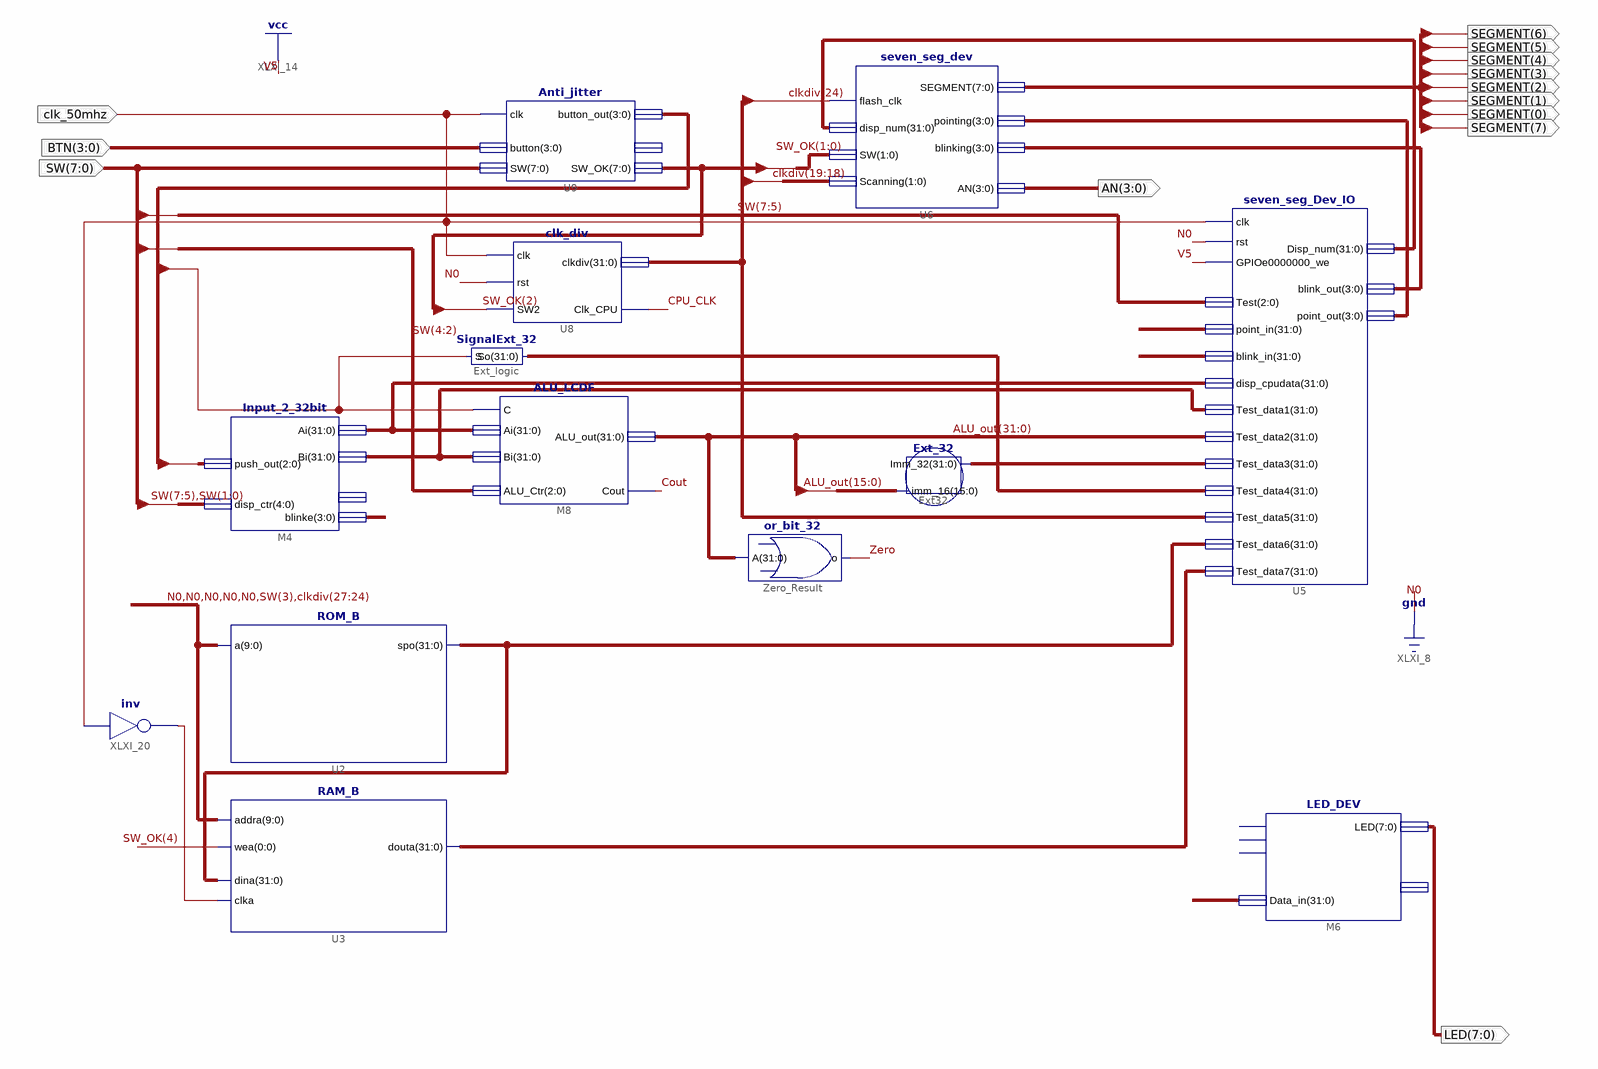
[diagram p0: schematic sheet 1]
// Xilinx ISE schematic Top.sch (spartan6) as structural Verilog: 13 symbols, 13 ports
module Top (
  input  [3:0] BTN,
  input  [7:0] SW,
  input  clk_50mhz,
  output [3:0] AN,
  output [7:0] LED,
  output [7:0] SEGMENT
);

  wire Cout, CPU_CLK, XLXN_200, Zero;
  wire [3:0] blinke, button_out, XLXN_17, XLXN_18;
  wire [7:0] SW_OK;
  wire [31:0] ALU_out, clkdiv, XLXN_53, XLXN_163, XLXN_164, XLXN_192, XLXN_201, XLXN_202, XLXN_207;

  Anti_jitter U9 (
    .clk(clk_50mhz), .SW(SW), .button_out(button_out), .SW_OK(SW_OK), .button(BTN));  // open: button_pulse
  Input_2_32bit M4 (
    .blinke(blinke), .disp_ctr({SW[7:5], SW[1:0]}), .Ai(XLXN_163), .push_out(button_out[2:0]), .Bi(XLXN_164));  // open: state
  ALU_LCDF M8 (.C(button_out[0]), .ALU_Ctr(SW[4:2]), .Ai(XLXN_163), .Bi(XLXN_164), .ALU_out(ALU_out), .Cout(Cout));
  LED_DEV M6 (
    .LED(LED), .Data_in({{24{1'b0}}, SW[1], CPU_CLK, Cout, Zero, clkdiv[27:24]}));  // open: clk, rst, EN, Other_out
  clk_div U8 (.clk(clk_50mhz), .rst(1'b0), .SW2(SW_OK[2]), .clkdiv(clkdiv), .Clk_CPU(CPU_CLK));
  Ext_32 Ext32 (.imm_16(ALU_out[15:0]), .Imm_32(XLXN_192));
  or_bit_32 Zero_Result (.o(Zero), .A(ALU_out));
  RAM_B U3 (
    .addra({{5{1'b0}}, SW[3], clkdiv[27:24]}), .clka(XLXN_200), .wea(SW_OK[4]), .dina(XLXN_201),
    .douta(XLXN_202));
  not XLXI_20 (XLXN_200, clk_50mhz);
  SignalExt_32 Ext_logic (.So(XLXN_207), .S(button_out[0]));
  ROM_B U2 (.a({{5{1'b0}}, SW[3], clkdiv[27:24]}), .spo(XLXN_201));
  seven_seg_Dev_IO U5 (
    .clk(clk_50mhz), .Test(SW[7:5]), .point_in({32{1'b1}}), .blink_in({{24{1'b0}}, blinke, blinke}),
    .disp_cpudata(XLXN_163), .Test_data1(XLXN_164), .Test_data2(ALU_out), .Test_data3(XLXN_192),
    .Test_data4(XLXN_207), .Test_data5(clkdiv), .Test_data6(XLXN_201), .Test_data7(XLXN_202),
    .blink_out(XLXN_18), .point_out(XLXN_17), .rst(1'b0), .GPIOe0000000_we(1'b1), .Disp_num(XLXN_53));
  seven_seg_dev U6 (
    .pointing(XLXN_17), .blinking(XLXN_18), .SW(SW_OK[1:0]), .Scanning(clkdiv[19:18]), .disp_num(XLXN_53),
    .flash_clk(clkdiv[24]), .SEGMENT(SEGMENT), .AN(AN));
endmodule
